# Altium schematic sheet 3_语音模块.schdoc.schdoc
size 309 x 223 mm; Symbol: Sheet-Symbol_A4; Device: Sheet-Symbol_A4; @Page Name: 语音模块; @Create Date: 2023-10-28; @Page Count: 4; @Page No: 2; @Project Name: New Project_2023-10-25_23-03-02; @Schematic Name: Schematic1; @Update Date: 2023-11-07; Company: 嘉立创EDA; Page Size: A4; Version: V1.0; SheetNumber: 2; SheetTotal: 4
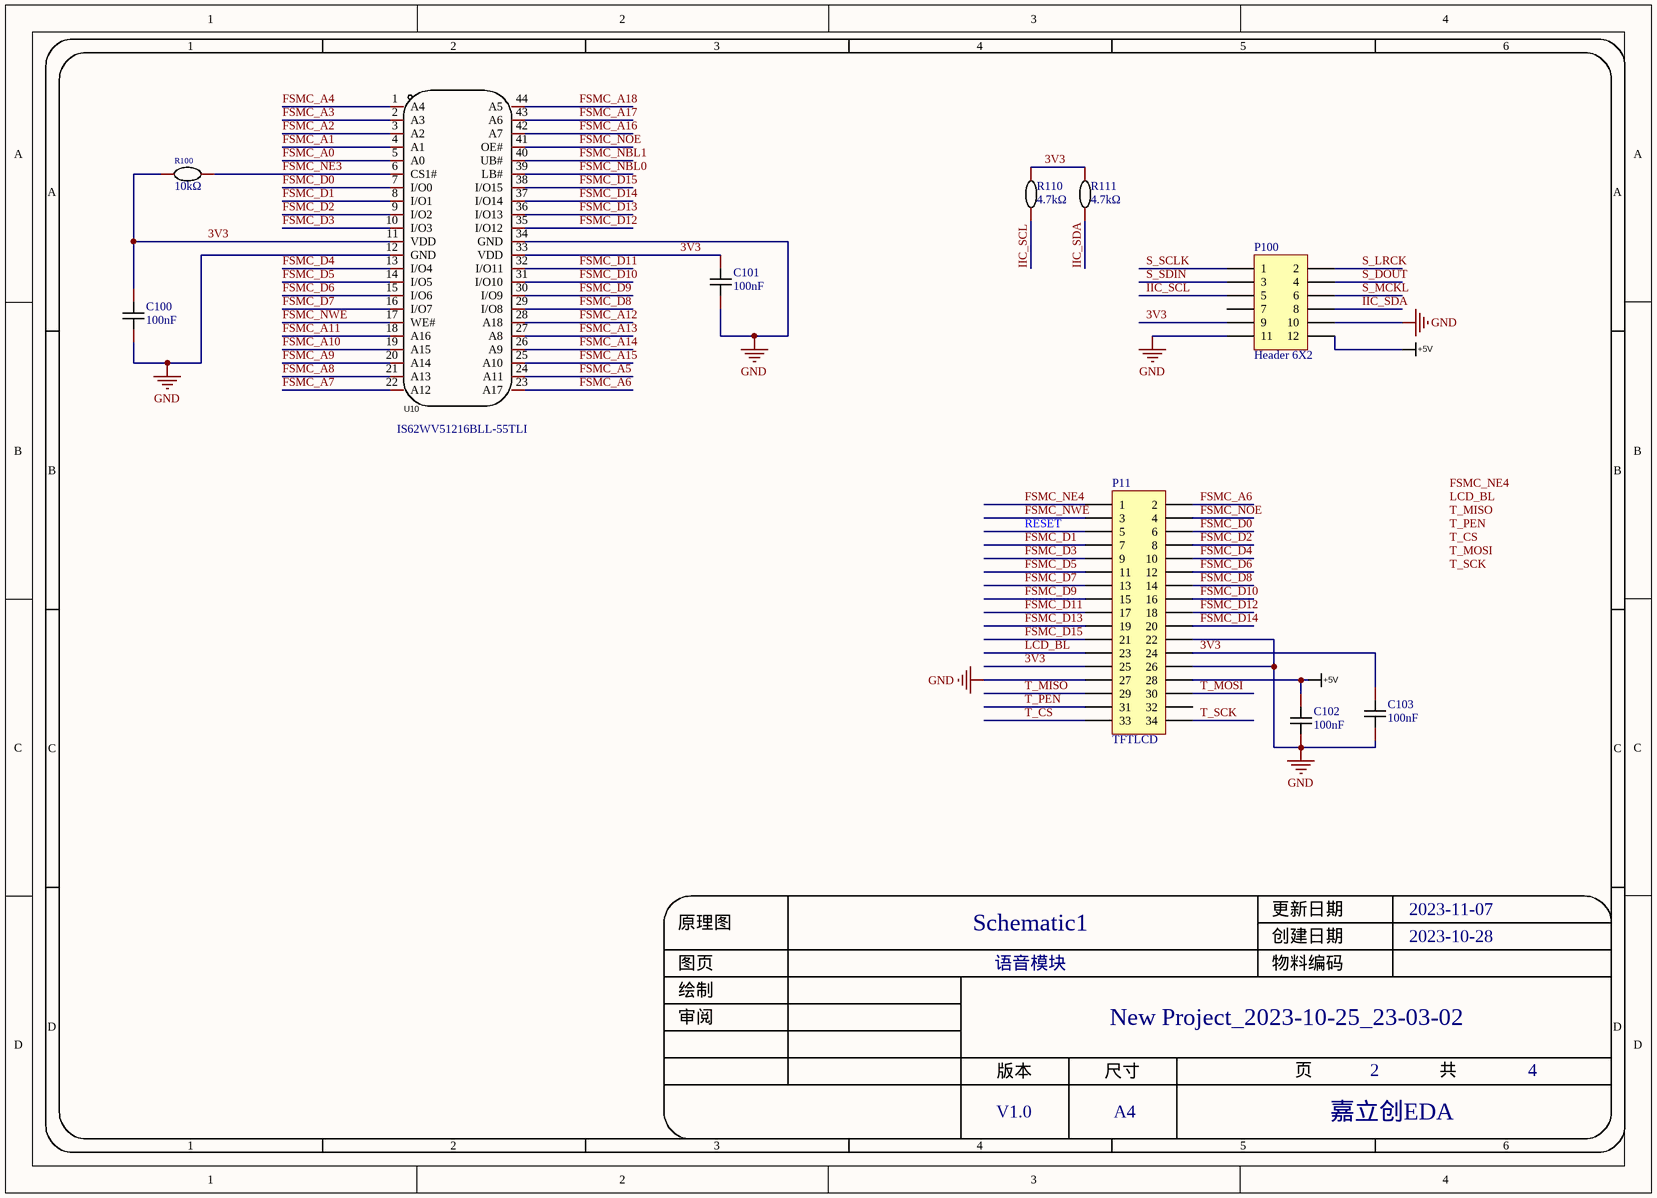
[diagram p0: 3_语音模块.schdoc.schdoc]

## Parts
C100  100nF  [C0603]
C101  100nF  [C0603]
C102  100nF  [C0603]
C103  100nF  [C0603]
P11  TFTLCD  [HDR2X17]
P100  Header 6X2  [HDR2X6]
R100  10kΩ  [R0603]
R110  4.7kΩ  [R0603]
R111  4.7kΩ  [R0603]
U10  IS62WV51216BLL-55TLI  [SRAM]

## Nets
+5V: C102.2 P11.28 P100.12
GND: C100.1 C101.1 C102.1 C103.1 P11.22 P11.26 P11.27 P100.10 P100.11 U10.12(GND) U10.34(GND)
3V3: C100.2 C101.2 C103.2 P11.24 P11.25 P100.9 R100.1 R110.2 R111.2 U10.11(VDD) U10.33(VDD)
FSMC_A0: U10.5(A0)
FSMC_A1: U10.4(A1)
FSMC_A2: U10.3(A2)
FSMC_A3: U10.2(A3)
FSMC_A4: U10.1(A4)
FSMC_A5: U10.24(A11)
FSMC_A6: P11.2 U10.23(A17)
FSMC_A7: U10.22(A12)
FSMC_A8: U10.21(A13)
FSMC_A9: U10.20(A14)
FSMC_A10: U10.19(A15)
FSMC_A11: U10.18(A16)
FSMC_A12: U10.28(A18)
FSMC_A13: U10.27(A8)
FSMC_A14: U10.26(A9)
FSMC_A15: U10.25(A10)
FSMC_A16: U10.42(A7)
FSMC_A17: U10.43(A6)
FSMC_A18: U10.44(A5)
FSMC_D0: P11.6 U10.7(I/O0)
FSMC_D1: P11.7 U10.8(I/O1)
FSMC_D2: P11.8 U10.9(I/O2)
FSMC_D3: P11.9 U10.10(I/O3)
FSMC_D4: P11.10 U10.13(I/O4)
FSMC_D5: P11.11 U10.14(I/O5)
FSMC_D6: P11.12 U10.15(I/O6)
FSMC_D7: P11.13 U10.16(I/O7)
FSMC_D8: P11.14 U10.29(I/O8)
FSMC_D9: P11.15 U10.30(I/O9)
FSMC_D10: P11.16 U10.31(I/O10)
FSMC_D11: P11.17 U10.32(I/O11)
FSMC_D12: P11.18 U10.35(I/O12)
FSMC_D13: P11.19 U10.36(I/O13)
FSMC_D14: P11.20 U10.37(I/O14)
FSMC_D15: P11.21 U10.38(I/O15)
FSMC_NBL0: U10.39(LB#)
FSMC_NBL1: U10.40(UB#)
FSMC_NE3: R100.2 U10.6(CS1#)
FSMC_NE4: P11.1
FSMC_NOE: P11.4 U10.41(OE#)
FSMC_NWE: P11.3 U10.17(WE#)
IIC_SCL: P100.5 R110.1
IIC_SDA: P100.8 R111.1
LCD_BL: P11.23
RESET: P11.5
S_DOUT: P100.4
S_LRCK: P100.2
S_MCKL: P100.6
S_SCLK: P100.1
S_SDIN: P100.3
T_CS: P11.33
T_MISO: P11.29
T_MOSI: P11.30
T_PEN: P11.31
T_SCK: P11.34

Not connected (* = marked no-connect by the designer): P11 32; P100 7

## Notes on the sheet
- Labels drawn without touching a wire or pin: FSMC_NE4, LCD_BL, T_CS, T_MISO, T_MOSI, T_PEN, T_SCK
- 1
- 2
- 3
- 4
- 5
- 6
- A
- B
- C
- 原理图
- Schematic1
- 创建日期
- 更新日期
- 2023-10-28
- 2023-11-07
- 审阅
- 绘制
- 图页
- 语音模块
- 物料编码
- New Project_2023-10-25_23-03-02
- D
- 版本
- 尺寸
- 页
- 共
- V1.0
- A4
- 嘉立创EDA

## Library data of the parts
C100-C103 = CGA3E3X8R1H104M080AE: 容值:100nF;精度:±20%;额定电压:50V;材质(温度系数):X8R;; Manufacturer: TDK; Add into BOM: yes; Tolerance: ±20%; Voltage Rated: 50V; Temperature Coefficient: X8R; Symbol: CGA3E3X8R1H104M080AE; Device: CGA3E3X8R1H104M080AE; LCSC Part Name: 100nF ±20% 50V; Supplier Part: C3855738; Manufacturer Part: CGA3E3X8R1H104M080AE; Supplier Footprint: 0603; Supplier: LCSC; Convert to PCB: yes; Value: 100nF; Name: 100nF
P11 = Header 17X2: Header, 17-Pin, Dual row; LatestRevisionDate: 17-Jul-2002; LatestRevisionNote: Re-released for DXP Platform.; Publisher: Altium Limited
P100 = Header 6X2: Header, 6-Pin, Dual row; LatestRevisionDate: 17-Jul-2002; LatestRevisionNote: Re-released for DXP Platform.; Publisher: Altium Limited
R100 = SCR0603J10K: 阻值:10kΩ;精度:±5%;; Manufacturer: VO(翔胜); Add into BOM: yes; Tolerance: ±5%; Name: 10kΩ; Symbol: SCR0603J10K; Device: SCR0603J10K; LCSC Part Name: 10kΩ ±5%; Supplier Part: C3017715; Manufacturer Part: SCR0603J10K; Supplier Footprint: 0603; JLCPCB Part Class: 扩展库; Datasheet: https://atta.szlcsc.com/upload/public/pdf/source/20220513/247AF9639BA21CF93567DC289CCC6A22.pdf; Supplier: LCSC; Convert to PCB: yes; Value: 10kΩ
R110 R111 = AR03FTDX4701A: 电阻类型:薄膜电阻;阻值:4.7kΩ;精度:±1%;功率:100mW;; Manufacturer: Viking(光颉); Add into BOM: yes; Tolerance: ±1%; Power(Watts): 100mW; Temperature Coefficient: ±50ppm/℃; Overload Voltage (Max): 75V; Name: 4.7kΩ; Symbol: AR03FTDX4701A; Device: AR03FTDX4701A; LCSC Part Name: 4.7kΩ ±1% 100mW; Supplier Part: C2924150; Manufacturer Part: AR03FTDX4701A; Supplier Footprint: 0603; JLCPCB Part Class: 扩展库; Datasheet: https://atta.szlcsc.com/upload/public/pdf/source/20211123/7AFDB03DAF68AA91648A852AAE26A3AB.pdf; Supplier: LCSC; Convert to PCB: yes; Type: 薄膜电阻; Value: 4.7kΩ; Operating Temperature Range: -55℃~+155℃
U10 = IS62WV51216BLL-55TLI: Manufacturer: ISSI(美国芯成); Add into BOM: yes; Symbol: IS62WV51216BLL-55TLI; Device: IS62WV51216BLL-55TLI; Supplier: LCSC; Manufacturer Part: IS62WV51216BLL-55TLI; Supplier Part: C11315; JLCPCB Part Class: Extended Part; LCSC Part Name: IS62WV51216BLL-55TLI; Supplier Footprint: TSOPII-44; Datasheet: https://atta.szlcsc.com/upload/public/pdf/source/20130225/1457706593006.pdf; Convert to PCB: yes